# Altium schematic sheet module.SchDoc
size A4
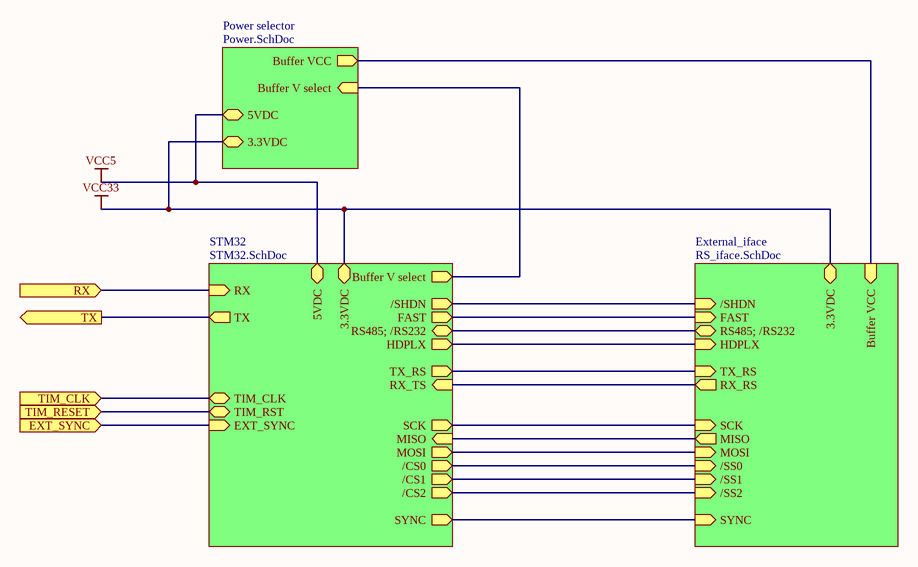
[diagram p0: module.SchDoc]

## Sub-sheets
External_iface = RS_iface.SchDoc: TX_RS (in), RX_RS (out), /SHDN (in), FAST (in), RS485; /RS232, HDPLX (in), SCK (in), MOSI (in), /SS1 (in), /SS2 (in), Buffer VCC (in), SYNC (in), /SS0 (in), MISO (out), 3.3VDC
Power selector = Power.SchDoc: Buffer VCC (out), Buffer V select (in), 5VDC, 3.3VDC
STM32 = STM32.SchDoc: TX_RS (out), RX_TS (in), /SHDN (out), FAST (out), HDPLX (out), Buffer V select (out), 3.3VDC, RS485; /RS232, SCK (out), MISO (in), MOSI (out), /CS2 (out), /CS1 (out), /CS0 (out), SYNC (out), TIM_CLK, EXT_SYNC (in), TIM_RST, 5VDC, TX (out), RX (in)

## Ports
EXT_SYNC (in), RX (in), TIM_CLK (in), TIM_RESET (in), TX (out)

## Nets
VCC5: sheet STM32/5VDC, sheet Power selector/5VDC
VCC33: sheet STM32/3.3VDC, sheet External_iface/3.3VDC, sheet Power selector/3.3VDC
EXT_SYNC: port EXT_SYNC, sheet STM32/EXT_SYNC
RX: port RX, sheet STM32/RX
TIM_CLK: port TIM_CLK, sheet STM32/TIM_CLK
TIM_RESET: port TIM_RESET, sheet STM32/TIM_RST
TX: port TX, sheet STM32/TX
(unnamed): sheet STM32/TX_RS, sheet External_iface/TX_RS
(unnamed): sheet STM32/RX_TS, sheet External_iface/RX_RS
(unnamed): sheet STM32//SHDN, sheet External_iface//SHDN
(unnamed): sheet STM32/FAST, sheet External_iface/FAST
(unnamed): sheet STM32/HDPLX, sheet External_iface/HDPLX
(unnamed): sheet STM32/Buffer V select, sheet Power selector/Buffer V select
(unnamed): sheet STM32/RS485; /RS232, sheet External_iface/RS485; /RS232
(unnamed): sheet STM32/SCK, sheet External_iface/SCK
(unnamed): sheet STM32/MISO, sheet External_iface/MISO
(unnamed): sheet STM32/MOSI, sheet External_iface/MOSI
(unnamed): sheet STM32//CS2, sheet External_iface//SS2
(unnamed): sheet STM32//CS1, sheet External_iface//SS1
(unnamed): sheet STM32//CS0, sheet External_iface//SS0
(unnamed): sheet STM32/SYNC, sheet External_iface/SYNC
(unnamed): sheet External_iface/Buffer VCC, sheet Power selector/Buffer VCC